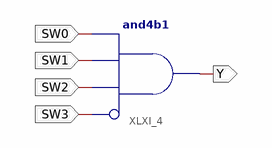
[diagram p0: schematic sheet 1]
// Xilinx ISE schematic exo1.sch (artix7) as structural Verilog: 1 symbols, 5 ports
module exo1 (
  input  SW0,
  input  SW1,
  input  SW2,
  input  SW3,
  output Y
);

  and XLXI_4 (Y, ~SW3, SW2, SW1, SW0);  // and4b1
endmodule
